# Altium schematic sheet USB A.SchDoc
size A4; SheetNumber: 8; SheetTotal: 9
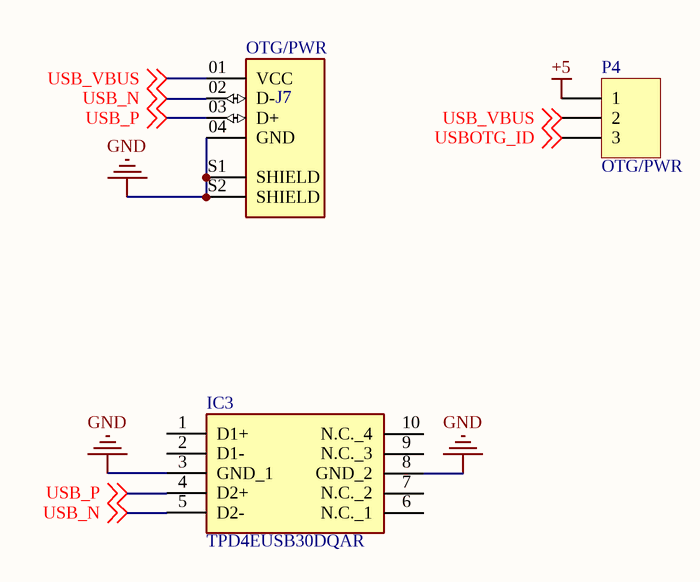
[diagram p0: USB A.SchDoc]

## Parts
IC3  TPD4EUSB30DQAR  [DQA(R-PUSON-N10)]
J7  OTG/PWR  [SAMTEC_USB-A-S-X-X-SM2]
P4  OTG/PWR  [HDR1X3]

## Nets
+5: P4.1
GND: IC3.3(GND_1) IC3.8(GND_2) J7.04(GND) J7.S1(SHIELD) J7.S2(SHIELD)
USB_N: IC3.5(D2-) J7.02(D-) ; off-sheet USB_N
USB_P: IC3.4(D2+) J7.03(D+) ; off-sheet USB_P
USB_VBUS: J7.01(VCC) P4.2 ; off-sheet USB_VBUS
USBOTG_ID: P4.3 ; off-sheet USBOTG_ID

Not connected (* = marked no-connect by the designer): IC3 1(D1+) 2(D1-) 6(N.C._1) 7(N.C._2) 9(N.C._3) 10(N.C._4)

## Library data of the parts
IC3 = TPD4EUSB30DQAR: Integrated Circuit; Manufacturer_Name: Texas Instruments; Datasheet Link: http://www.ti.com/lit/gpn/tpd4eusb30; Manufacturer_Part_Number: TPD4EUSB30DQAR; Mouser Part Number: 595-TPD4EUSB30DQAR; Mouser Price/Stock: https://www.mouser.co.uk/ProductDetail/Texas-Instruments/TPD4EUSB30DQAR?qs=Ze4%2FuFuz19JpY4uqYOLMbQ%3D%3D; Arrow Part Number: TPD4EUSB30DQAR; Arrow Price/Stock: https://www.arrow.com/en/products/tpd4eusb30dqar/texas-instruments?region=nac
J7 = USB-A-S-X-X-SM2: USB-A (USB TYPE-A) USB 2.0 Receptacle Connector 4 Position Surface Mount, Right Angle; MP: USB-A-S-F-B-SM2; MF: Samtec; SnapEDA_Link: https://www.snapeda.com/parts/USB-A-S-F-B-SM2/Samtec%20Inc./view-part/937545/?ref=snap; Value: *; Availability: Unavailable; DigiKey-Purchase-URL: https://snapeda.com/shop?store=DigiKey&id=937545; Package: None; Toby_UK-Purchase-URL: https://snapeda.com/shop?store=Toby+UK&id=937545; Price: None
P4 = Header 3: Header, 3-Pin; LatestRevisionDate: 17-Jul-2002; LatestRevisionNote: Re-released for DXP Platform.; Publisher: Altium Limited